# Altium schematic sheet Ethernet.SchDoc
size A4
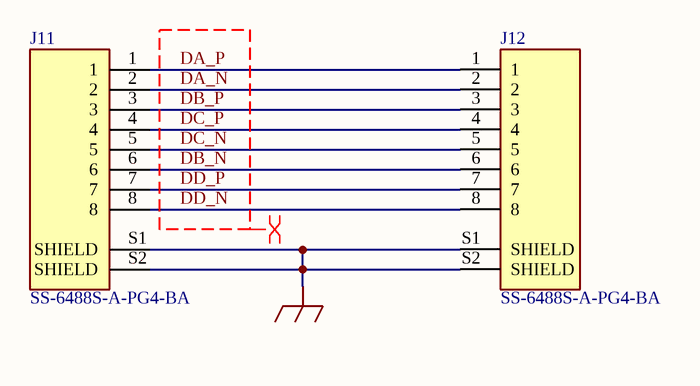
[diagram p0: Ethernet.SchDoc]

## Parts
J11  SS-6488S-A-PG4-BA  [SS-6488S-A-PG4-BA]
J12  SS-6488S-A-PG4-BA  [SS-6488S-A-PG4-BA]

## Nets
FGND: J11.S1(SHIELD) J11.S2(SHIELD) J12.S1(SHIELD) J12.S2(SHIELD)
DA_N: J11.2 J12.2
DA_P: J11.1 J12.1
DB_N: J11.6 J12.6
DB_P: J11.3 J12.3
DC_N: J11.5 J12.5
DC_P: J11.4 J12.4
DD_N: J11.8 J12.8
DD_P: J11.7 J12.7

## Layout directives
differential pair: DA_N, DA_P, DB_N, DB_P, DC_N, DC_P, DD_N, DD_P

## Library data of the parts
J11 J12 = SS-6488S-A-PG4-BA: Jack Modular Connector 8p8c (RJ45, Ethernet) 90Â° Angle (Right) Shielded, EMI Finger; MF: Bel Fuse; Package: None; Availability: Good; Value: *; MP: SS-6488S-A-PG4-BA; DigiKey-Purchase-URL: https://snapeda.com/shop?store=DigiKey&id=700071; Arrow_Europe-Purchase-URL: https://snapeda.com/shop?store=Arrow+Europe&id=700071; SnapEDA_Link: https://www.snapeda.com/parts/SS-6488S-A-PG4-BA/Stewart%20Connector/view-part/700071/?ref=snap; Price: None; Mouser-Purchase-URL: https://snapeda.com/shop?store=Mouser&id=700071; Check_prices: https://www.snapeda.com/parts/SS-6488S-A-PG4-BA/Stewart%20Connector/view-part/700071/?ref=eda